# EAGLE design YOTSUBA_+Y+Z_ver.1.3 (EAGLE 9.6.2)
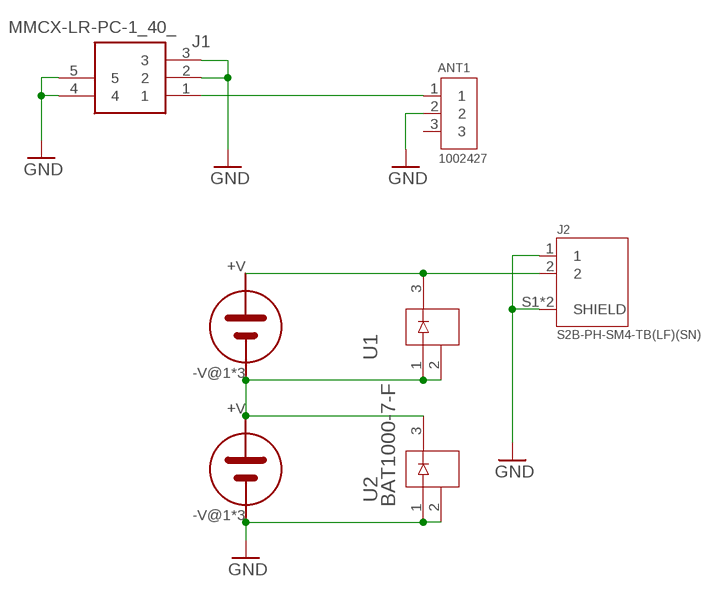
[diagram p0: schematic, sheet 1]

## Parts
ANT1  1002427  [ANTENNA_1002427]
J1  MMCX-LR-PC-1_40_  [MMCXLRPC140]
J2  S2B-PH-SM4-TB(LF)(SN)  [JST_S2B-PH-SM4-TB(LF)(SN)]
U1  BAT1000-7-F  [SOT23_BAT_DIO]
U2  BAT1000-7-F  [SOT23_BAT_DIO]
U$2  3G30A  [SOLAR_3G30A]
U$3  3G30A  [SOLAR_3G30A]

## Nets
GND [GND]: ANT1.2 J1.2 J1.3 J1.4 J1.5 J2.1 J2.S1(SHIELD) J2.S2(SHIELD) U2.1 U2.2 U$3.-V@1(-V) U$3.-V@2(-V) U$3.-V@3(-V)
N$5: U1.1 U1.2 U2.3 U$2.-V@1(-V) U$2.-V@2(-V) U$2.-V@3(-V) U$3.+V
N$6: J2.2 U1.3 U$2.+V
RF2 [ANTENNA]: ANT1.1 J1.1
Unconnected: ANT1.3

## Library data of the parts
ANT1 = 1002427:1002427: RF ANT 868MHZ/915MHZ STAMPED MET; DESCRIPTION: 868MHz, 915MHz, 1.575GHz Beidou, GLONASS, GPS, ISM, LoRa, LPWAN, Sigfox Stamped Metal RF Antenna 868MHz, 915MHz, 1.561GHz ~ 1.602GHz 3dBi Solder Surface Mount; DIGI-KEY_PART_NUMBER: 478-1002427TR-ND; MF: Ethertronics/AVX; MP: 1002427; PACKAGE: None; PURCHASE-URL: https://pricing.snapeda.com/search/part/1002427/?ref=eda
J1 = MMCX-LR-PC-1_40_:MMCX-LR-PC-1_40_: RF Connectors / Coaxial Connectors MINI PUSH-ON CONN RECEPT RA Source: Datasheet <https://componentsearchengine.com/Datasheets/1/MMCX-LR-PC-1(40).pdf>; DESCRIPTION: RF Connectors / Coaxial Connectors MINI PUSH-ON CONN RECEPT RA; HEIGHT: 3.95mm; MANUFACTURER_NAME: Hirose; MANUFACTURER_PART_NUMBER: MMCX-LR-PC-1(40); MOUSER_PART_NUMBER: 798-MMCX-LR-PC-1(40); MOUSER_PRICE-STOCK: https://www.mouser.co.uk/ProductDetail/Hirose-Connector/MMCX-LR-PC-140?qs=XQjbzJWzFPVvtPijmLd%2FXQ%3D%3D
J2 = S2B-PH-SM4-TB_LF__SN_:S2B-PH-SM4-TB(LF)(SN): PH Series 2 Position 2 mm Pitch Surface Mount Side Entry Shrouded Header; DESCRIPTION: Connector Header Surface Mount, Right Angle 2 position 0.079 (2.00mm); DIGI-KEY_PART_NUMBER: 455-1749-2-ND; MF: JST Sales; MP: S2B-PH-SM4-TB(LF)(SN); PACKAGE: None; PURCHASE-URL: https://pricing.snapeda.com/search/part/S2B-PH-SM4-TB(LF)(SN)/?ref=eda
U1 U2 = BAT1000:BAT1000-7-F; COPYRIGHT: Copyright (C) 2023 Ultra Librarian. All rights reserved.; DIGIKEY_PART_NUMBER_1: BAT1000-7FDITR-ND; DIGIKEY_PART_NUMBER_2: BAT1000-7FDICT-ND; DIGIKEY_PART_NUMBER_3: BAT1000-7FDIDKR-ND; MANUFACTURER_PART_NUMBER: BAT1000-7-F; MFR_NAME: Diodes Inc
U$2 U$3 = 3G30A_normal:3G30A

## Net classes
2 GND: clearance 0.5 mm to class 0, clearance 0.21 mm to class 1, clearance 0.5 mm

## Board
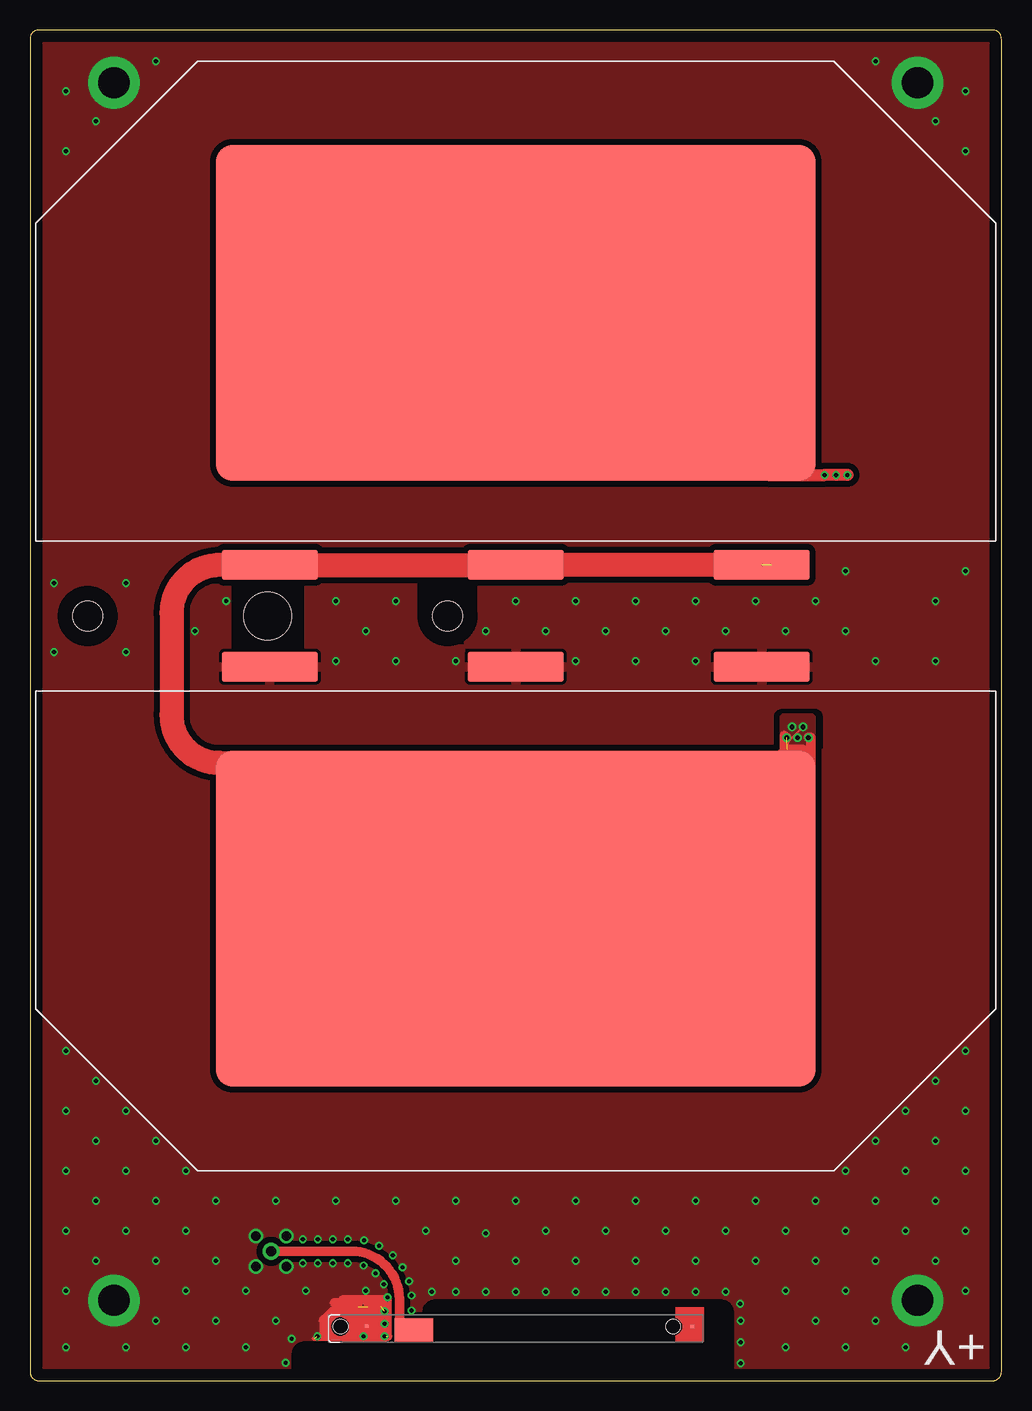
[diagram p1: board, top side]
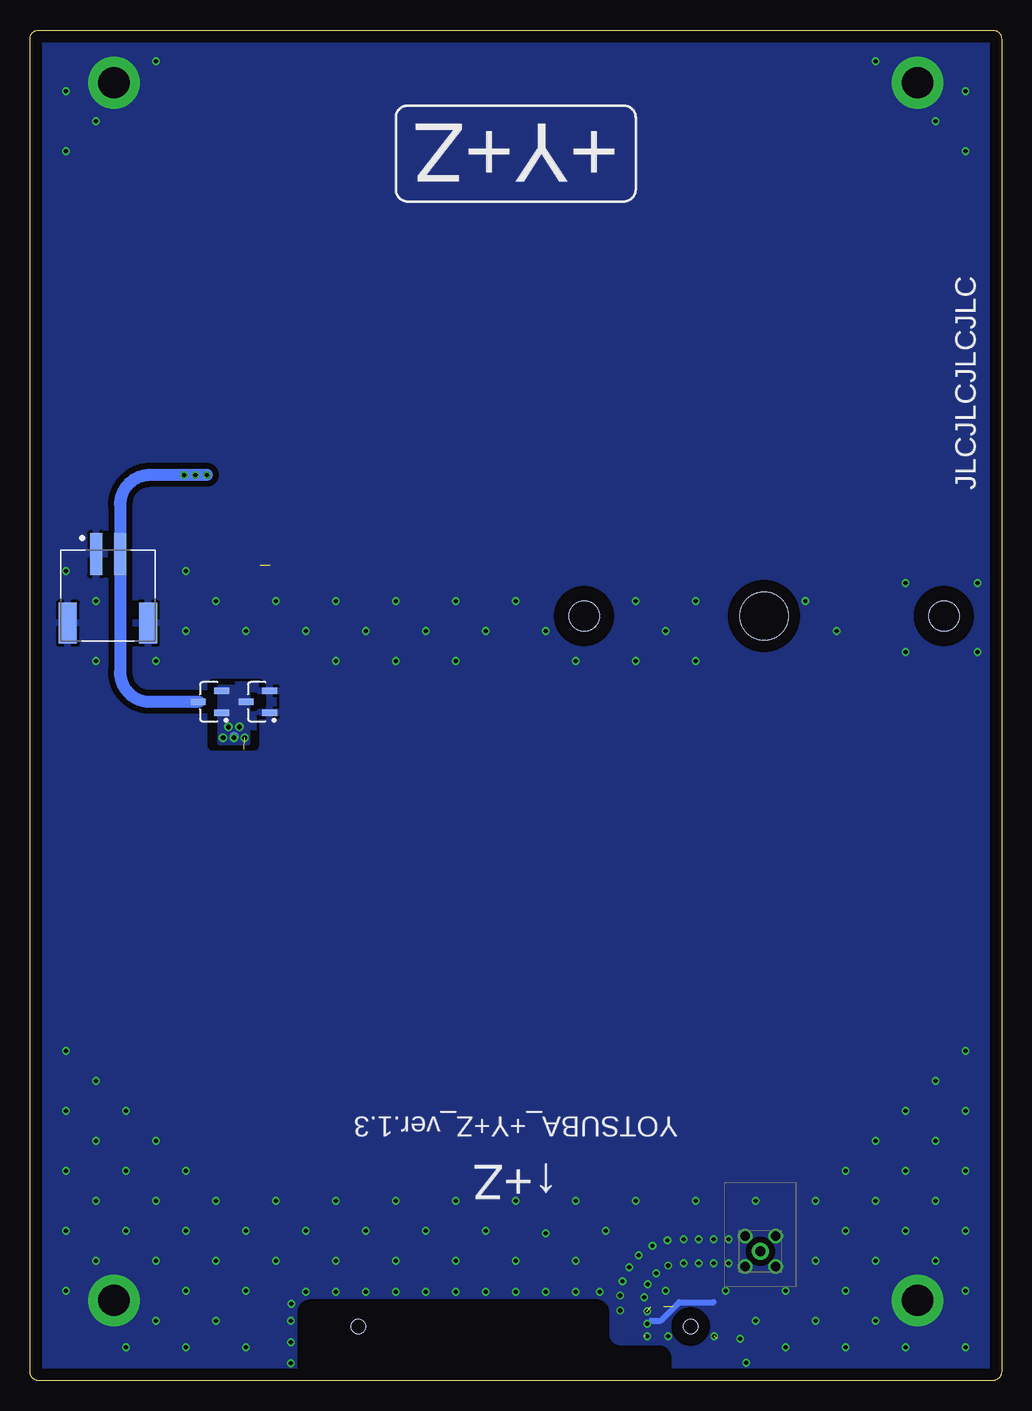
[diagram p2: board, bottom side, seen from below]

Size 81 x 112.6 mm. Coordinates in mm from the lower left corner, seen from the top.
Outline: 81,0.75 81,111.85 arc90 80.25,112.6 0.75,112.6 arc90 0,111.85 0,0.75 arc90 0.75,0 80.25,0 arc90 81,0.75
Copper layers (1*16): Top 0.035mm / dielectric 1.53mm / Bottom 0.035mm
Design rules "pban_5mil-l2 *": minimum track width 5mil, minimum drill 0.3mm, track to track 5mil, track to pad 0.229mm, pad to pad 5mil, via to via 5mil, smd to smd 5mil, copper to edge 1mm, drill to drill 0.5mm, minimum pad ring 0.15mm, minimum via ring 0.15mm, stop-mask expansion 4mil, vias tented up to drill 0.5mm, thermal gap 10mil
Holes 4 mm at 19.8,63.75
Holes 2.5 mm at 4.8,63.75 34.8,63.75
tRestrict: area 2.4,61.4 to 7.2,66.2; area 32.4,61.4 to 37.2,66.2; 18 lines
bRestrict: area 2.4,61.4 to 7.2,66.2; area 32.4,61.4 to 37.2,66.2; 20 lines

### Footprints (pad centres in the part's own frame; a part is rotated, then mirrored left to right if it is on the bottom)
ANTENNA_1002427 = smd 3.2 x 1.9: 1 24.1,-1.05 | smd 0.3 x 0.3: 2 28.02,-1.375; 3 0.875,-1.325 | hole 1.2: 2.46,-1.3; 30.2,-1.3
MMCXLRPC140 = drill 0.85 pad 1.422: 1 0,0 | drill 0.8: 2 -1.27,-1.27; 3 1.27,-1.27; 4 1.27,1.27; 5 -1.27,1.27
JST_S2B-PH-SM4-TB(LF)(SN) = smd 1 x 3.5: 1 -1,0; 2 1,0 | smd 1.5 x 3.4: S1 -3.35,-5.75; S2 3.35,-5.75
SOT23_BAT_DIO = smd 0.568 x 1.259: 1 -0.915,-0.965; 2 0.915,-0.965; 3 0,0.965
SOLAR_3G30A = smd 50 x 28: +V 0,19 | smd 8 x 2.5: -V@1 -20.5,-2; -V@2 20.5,-2; -V@3 0,-2

### Placement (x,y rotation side)
ANT1  56.1,3.2 180 top
J1  20.1,10.8 90 bottom
J2  74.5,68.9 0 bottom
U1  66,56.6 90 bottom
U2  62,56.6 90 bottom
U$2  40.5,70 0 top
U$3  40.5,57.5 180 top

### Tracks (layer width: path | path; a pad name or v marks a point on that pad's centre or on a via)
GND  (via drill 0.35, 2.6 pad 4.3)  (4 unrouted)
  Top 0.2: 28.4,3.85 28.35,3.97
  Top 0.305: 28.35,4.31 28.35,3.97 28.35,3.5 28.14,3.5
  Top 0.4: 28.14,3.5 23.7,3.5 | 24.6,3.8 25.2,3.8
  Top 0.8: 29.79,4.72 29.79,6.75 26.1,6.75 26.1,6.5 | 26.1,6.5 25.4,6.5 | 26.1,6.5 26.1,5.7 25.3,5.7 | 29.79,4.72 29.79,3.71 29.8,3.7 | 29.25,6.15 28.2,6.15 | 27.35,6.15 26.3,6.15 | 29.79,4.72 28.08,4.72 ANT1.2 | 29.13,3.7 29.7,3.7
  Top 1: 24.6,5 24.6,3.8
  Top 1.016: 25.3,5.7 24.6,5
  Bottom 0.5: 29.2,5 28.4,5 26.86,6.54 23.98,6.54
  other vias: 33.5,7.4 78,27.5 75.5,25 73,22.5 78,22.5 75.5,20 70.5,20 68,17.5 73,17.5 78,17.5 70.5,15 75.5,15 78,12.5 78,7.5 73,12.5 68,12.5 60.5,10 65.5,10 70.5,10 68,7.5 63,7.5 63,2.8 65.5,5 70.5,5 68,2.8 73,2.8 45.5,10 40.5,10 38,12.3 35.5,10 33,12.5 35.5,15 30.5,15 15.5,10 48,12.5 50.5,15 13,17.5 8,17.5 10.5,20 5.5,20 8,22.5 5.5,25 3,22.5 3,27.5 18,2.8 13,2.8 8,2.8 10.5,5 3,2.8 3,7.5 7,6.7 3,17.5 13,7.5 10.5,10 35.5,7.4 40.5,7.4 45.5,7.4 50.5,7.4 55.5,7.4 59.25,1.45 21.3,1.5 38,7.4 43,7.4 48,7.4 53,7.4 58,7.4 59.25,5 59.25,3.2 23.95,3.7 75.5,60 70.5,60 75.5,65 78,67.5 8,60.75 8,66.5 2,66.5 3,107.5 5.5,105 10.5,110 70.5,110 78,102.5 78,107.5 43,12.5 21.8,3.5 59.2,6.4 25.5,15 20.5,15 13,12.5 15.5,15 10.5,15 8,12.5 5.5,15 3,12.5 5.5,10 3,102.5 75.5,105 28,62.5 25.5,65 30.5,65 30.5,60 25.5,60 35.5,60 38,62.5 40.5,65 43,62.5 45.5,65 48,62.5 45.5,60 50.5,60 53,62.5 50.5,65 55.5,65 58,62.5 55.5,60 60.5,65 63,62.5 65.5,65 68,62.5 68,67.5 40.5,15 45.5,15 55.5,10 50.5,10 53,12.5 55.5,15 58,12.5 60.5,15 63,12.5 65.5,15 75.5,10 15.5,5 18,7.5 20.5,5 23,7.5 28,7.5 22.75,9.8 24,9.8 25.25,9.8 26.5,9.8 22.75,11.8 24,11.8 25.25,11.8 26.5,11.8 29.55,4.75 29.5,8.05 27.8,3.7 27.8,9.6 28.8,8.95 31.8,5.85 29.55,3.7 31.8,7.1 29.8,6.95 29.55,5.8 27.85,11.7 29.1,11.25 30.25,10.45 31.05,9.45 31.6,8.3 2,60.75 13.75,62.5 16.35,65 74,6.7 74,108.2 7,108.2
  pour Top: -5.15,103.9 arc90 -5.4,103.65 -5.4,-4.85 arc90 -4.85,-5.4 88.1,-5.4 88.1,103.65 arc90 76.85,114.9 -2.15,114.9 -5.15,111.9
  pour Bottom: 88.8,119.7 -9.1,119.7 -9.1,-8.8 88.8,-8.8
N$5  (via drill 0.4)  (2 unrouted)
  Top 0.152: 62.9,51.75 62.28,51.13 | 62.28,51.13 62.17,51.02 53.02,51.02 U$3.+V | 62.28,51.13 62.28,52.33 v64.45,54.5
  Top 0.8: U$3.+V 65.1,38.5 | 62.9,53.6 v63.1,53.6 | v64.9,53.6 65.1,53.6 65.1,51.2 63.8,51.2 | 64.45,52.6 63.15,52.6 | 62.9,53.8 62.9,51.75 62.9,51.4
  Top 2: U$3.+V 40.5,51.5 15.8,51.5 arc-90 11.8,55.5 11.8,64 arc-90 15.8,68 U$2.-V@1 U$2.-V@3 61.8,68
  Bottom 0.8: v64,53.6 64,53.7
  other vias: 63.55,54.5
  pour Bottom (no thermals): 65.2,53.2 62.8,53.2 62.8,57.8 65.2,57.8
  pour Top: 62.6,50.9 62.6,55.2 arc-90 62.9,55.5 65.1,55.5 arc-90 65.4,55.2 65.4,50.9
  pour Top: 62.6,50.95 62.6,55.25 arc-90 62.9,55.55 65.1,55.55 arc-90 65.4,55.25 65.4,50.95
  pour Top: 62.6,50.95 62.6,55.25 arc-90 62.9,55.55 65.1,55.55 arc-90 65.4,55.25 65.4,50.95
N$6  (via drill 0.35)
  Top 1: 51.65,89 U$2.+V | 60.8,78.1 61.55,78.1 61.55,75.5 v66.25,75.5 v68.15,75.5
  Top 2: U$2.+V 40.56,83.39 40.59,82.78 | 40.59,82.78 40.79,78.5 | 40.59,82.78 41.71,83.9 45.3,83.9 51.1,78.1 60.8,78.1
  Bottom 1: 66.9,56.6 U1.3 71,56.6 arc90 73.5,59.1 J2.2 73.5,73 arc90 71,75.5 v68.15,75.5 v67.2,75.5 v66.25,75.5
RF2
  Top 0.152: ANT1.1 31.37,4.25 31.12,4.49
  Top 0.8: ANT1.1 31.8,4.25 | ANT1.1 31.55,4.25 | J1.1 26.8,10.8 arc-90 30.8,6.8 30.8,4.25 ANT1.1
(copper drawn outside any net)
  shapes: Top circle x1

### Text on the board
tNames: +Y
bNames: +Y+Z | JLCJLCJLCJLC | YOTSUBA_+Y+Z_ver.1.3 | ↑+Z